# Altium schematic sheet Motor Driver.SchDoc (part 1 of 3)
size A4; SheetNumber: 3; SheetTotal: 5
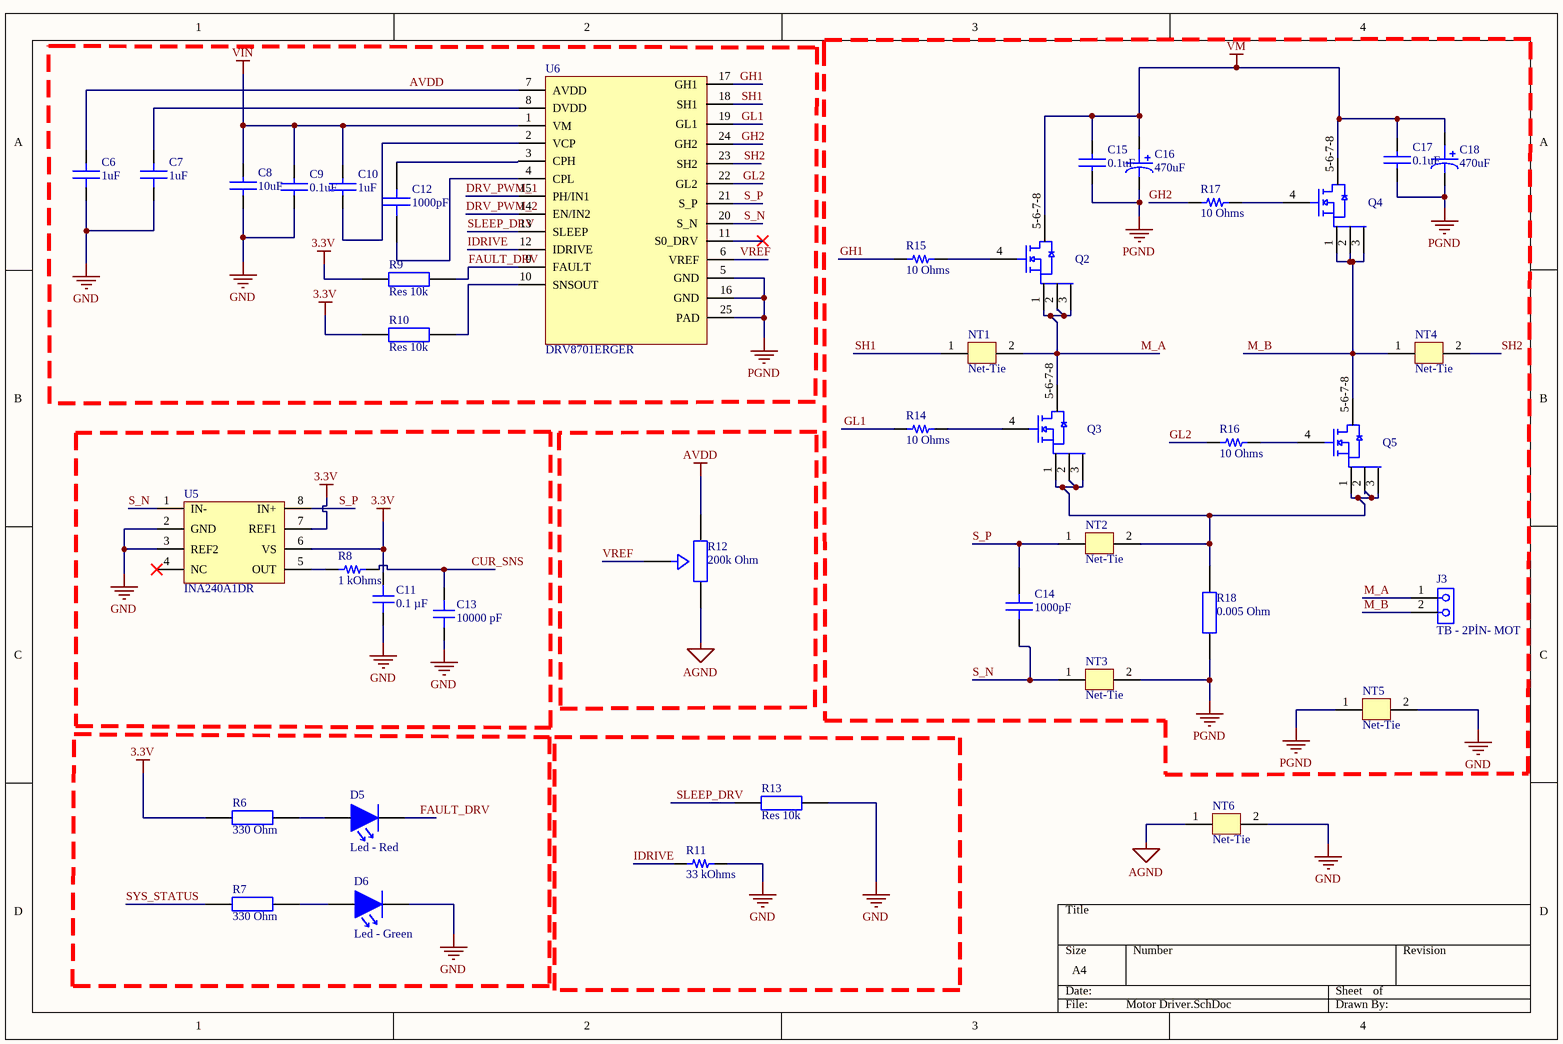
[diagram p0: Motor Driver.SchDoc]

## Parts
C6  1uF  [CAP0603-GRM188R60J105KA01D]
C7  1uF  [CAP0603-GRM188R60J105KA01D]
C8  10uF  [CAP1210- GRM32ER71H106KA12L]
C9  0.1uF  [CAP1206- GRM319R71H104KA01D]
C10  1uF  [CAP1206- GRM319R71C105KAA3D]
C11  0.1 µF  [CAP 0603_1608]
C12  1000pF  [CAP0402- GRM155R71C102KA01D]
C13  10000 pF  [CAP 0402_1005]
C14  1000pF  [CAP0402- GRM155R71C102KA01D]
C15  0.1uF  [CAP1206- GRM319R71H104KA01D]
C16  470uF  [RCAP, 8x20mm -EEU-FR1V471LB]
C17  0.1uF  [CAP1206- GRM319R71H104KA01D]
C18  470uF  [RCAP, 8x20mm -EEU-FR1V471LB]
D5  Led - Red  [LED_0805]
D6  Led - Green  [LED_0805]
J3  TB - 2PİN- MOT  [TB - 2PİN- MOT]
NT1  Net-Tie  [Net-Tie]  (net tie, no BOM)
NT2  Net-Tie  [Net-Tie]  (net tie, no BOM)
NT3  Net-Tie  [Net-Tie]  (net tie, no BOM)
NT4  Net-Tie  [Net-Tie]  (net tie, no BOM)
NT5  Net-Tie  [Net-Tie]  (net tie, no BOM)
NT6  Net-Tie  [Net-Tie]  (net tie, no BOM)
Q2  BSC010N04LSI  [SON 5X6]  (value not drawn)
Q3  BSC010N04LSI  [SON 5X6]  (value not drawn)
Q4  BSC010N04LSI  [SON 5X6]  (value not drawn)
Q5  BSC010N04LSI  [SON 5X6]  (value not drawn)
R6  330 Ohm  [RES0603- RC0603FR-07330RL]
R7  330 Ohm  [RES0603- RC0603FR-07330RL]
R8  1 kOhms  [RES 0603_1608]
R9  Res 10k  [RES0402 - ERJ-2RKF1002X]
R10  Res 10k  [RES0402 - ERJ-2RKF1002X]
R11  33 kOhms  [RES 1206_3216]
R12  200k Ohm  [3352P-1-204LF]
R13  Res 10k  [RES0402 - ERJ-2RKF1002X]
R14  10 Ohms  [RES 0805_2012]
R15  10 Ohms  [RES 0805_2012]
R16  10 Ohms  [RES 0805_2012]
R17  10 Ohms  [RES 0805_2012]
R18  0.005 Ohm  [KRL11050-C-R005-F-T1]
U5  INA240A1DR  [INA240A1DR]
U6  DRV8701ERGER  [DRV8701ERGER]

## Nets
3.3V: C11.2 R6.1 R9.1 R10.1 U5.6(VS) U5.7(REF1)
AGND: NT6.1 R12.3
AVDD: C6.2 R12.2 U6.7(AVDD)
GND: C6.1 C7.1 C8.1 C9.1 C11.1 C13.1 D6.1 NT5.2 NT6.2 R11.1 R13.2 U5.2(GND) U5.3(REF2)
PGND: C15.1 C16.N C17.1 C18.N NT3.2 NT5.1 R18.1 U6.5(GND) U6.16(GND) U6.25(PAD)
VIN: C8.2 C9.2 C10.2 U6.1(VM)
VM: C15.2 C16.P C17.2 C18.P Q2.5-6-7-8(D) Q4.5-6-7-8(D)
CUR_SNS: C13.2 R8.2
DRV_PWM_1: U6.15(PH/IN1)
DRV_PWM_2: U6.14(EN/IN2)
FAULT_DRV: D5.1 R9.2 U6.9(FAULT)
GH1: R15.1 U6.17(GH1)
GH2: R17.1 U6.24(GH2)
GL1: R14.1 U6.19(GL1)
GL2: R16.1 U6.22(GL2)
IDRIVE: R11.2 U6.12(IDRIVE)
M_A: J3.1 NT1.2 Q2.1(S) Q2.2(S) Q2.3(S) Q3.5-6-7-8(D)
M_B: J3.2 NT4.1 Q4.1(S) Q4.2(S) Q4.3(S) Q5.5-6-7-8(D)
S_N: C14.1 NT3.1 U5.1(IN-) U6.20(S_N)
S_P: C14.2 NT2.1 U5.8(IN+) U6.21(S_P)
SH1: NT1.1 U6.18(SH1)
SH2: NT4.2 U6.23(SH2)
SLEEP_DRV: R13.1 U6.13(SLEEP)
SYS_STATUS: R7.1
VREF: R12.1 U6.6(VREF)
NetC7_2: C7.2 U6.8(DVDD)
NetC10_1: C10.1 U6.2(VCP)
NetC12_1: C12.1 U6.4(CPL)
NetC12_2: C12.2 U6.3(CPH)
NetD5_2: D5.2 R6.2
NetD6_2: D6.2 R7.2
NetNT2_2: NT2.2 Q3.1(S) Q3.2(S) Q3.3(S) Q5.1(S) Q5.2(S) Q5.3(S) R18.2
NetQ2_4: Q2.4(G) R15.2
NetQ3_4: Q3.4(G) R14.2
NetQ4_4: Q4.4(G) R17.2
NetQ5_4: Q5.4(G) R16.2
NetR8_1: R8.1 U5.5(OUT)
NetR10_2: R10.2 U6.10(SNSOUT)

Not connected (* = marked no-connect by the designer): U5 4(NC)*; U6 11(S0_DRV)*